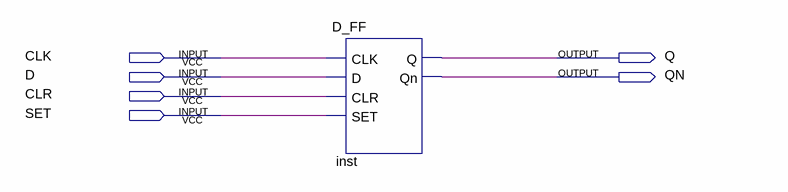
[diagram p0: schematic sheet]
// Quartus schematic Dff.bdf as structural Verilog: 1 symbols, 6 pins
module Dff (
  input  CLK,
  input  D,
  input  CLR,
  input  SET,
  output Q,
  output QN
);

  D_FF inst (.CLK(CLK), .D(D), .CLR(CLR), .SET(SET), .Q(Q), .Qn(QN));
endmodule
